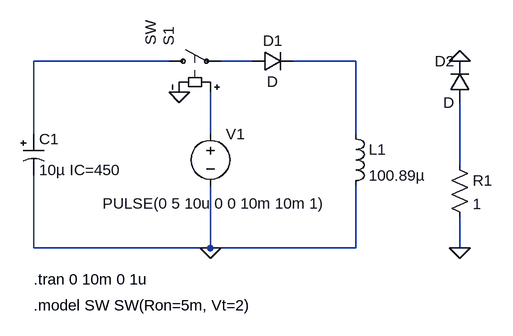
[diagram p0: schematic Coilgun-1V01.asc]
Coilgun-1V01.asc, the LTspice schematic file:
Version 4
SHEET 1 880 680
WIRE -560 -144 -768 -144
WIRE -432 -144 -480 -144
WIRE -272 -144 -368 -144
WIRE -768 -32 -768 -144
WIRE -496 -32 -496 -96
WIRE -272 -32 -272 -144
WIRE -112 16 -112 -80
WIRE -768 144 -768 32
WIRE -496 144 -496 48
WIRE -496 144 -768 144
WIRE -272 144 -272 48
WIRE -272 144 -496 144
WIRE -112 144 -112 96
FLAG -496 144 0
FLAG -544 -96 0
FLAG -112 -144 0
FLAG -112 144 0
SYMBOL polcap -784 -32 R0
WINDOW 3 24 56 Left 2
SYMATTR Value 10µ IC=450
SYMATTR InstName C1
SYMATTR SpiceLine V=63 Irms=900m Rser=0.1 Lser=0
SYMATTR Description Capacitor
SYMATTR Type cap
SYMBOL ind -288 -48 R0
SYMATTR InstName L1
SYMATTR Value 100.89µ
SYMATTR SpiceLine Rser=0.133
SYMBOL sw -576 -144 R270
WINDOW 3 24 -12 Left 2
WINDOW 38 24 -12 Left 2
SYMATTR Value ""
SYMATTR SpiceModel SW
SYMATTR InstName S1
SYMBOL voltage -496 -48 R0
WINDOW 3 -166 123 Left 2
WINDOW 123 0 0 Left 2
WINDOW 39 0 0 Left 2
SYMATTR Value PULSE(0 5 10u 0 0 10m 10m 1)
SYMATTR InstName V1
SYMBOL diode -96 -80 R180
WINDOW 0 24 64 Left 2
WINDOW 3 24 0 Left 2
SYMATTR InstName D2
SYMBOL diode -432 -128 R270
WINDOW 0 32 32 VTop 2
WINDOW 3 0 32 VBottom 2
SYMATTR InstName D1
SYMBOL res -128 0 R0
SYMATTR InstName R1
SYMATTR Value 1
TEXT -768 192 Left 2 !.tran 0 10m 0 1u
TEXT -768 232 Left 2 !.model SW SW(Ron=5m, Vt=2)

The netlist it stands for:
* Coilgun-1V01.asc
C1 N001 0 10µ IC=450 V=63 Irms=900m Rser=0.1 Lser=0
L1 N003 0 100.89µ Rser=0.133
S1 N001 N002 N004 0 SW
V1 N004 0 PULSE(0 5 10u 0 0 10m 10m 1)
D2 N005 0 D
D1 N002 N003 D
R1 N005 0 1
.model D D
.lib standard.dio
.tran 0 10m 0 1u
.model SW SW(Ron=5m, Vt=2)
.backanno
.end